# EAGLE design power (EAGLE 7.2.0)
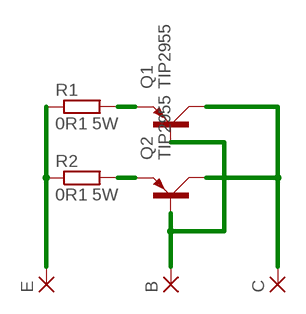
[diagram p0: schematic, sheet 1]

## Parts
B  3,81/1,4  [3,81/1,4]
C  3,81/1,4  [3,81/1,4]
E  3,81/1,4  [3,81/1,4]
Q1  TIP2955  [TOP3AV]
Q2  TIP2955  [TOP3AV]
R1  0R1 5W  R-EU_0207/15  [0207/15]
R2  0R1 5W  R-EU_0207/15  [0207/15]

## Nets
N$1: E.1(P) R1.1 R2.1
N$2: Q1.E R1.2
N$3: Q2.E R2.2
N$4: C.1(P) Q1.C Q2.C
N$5: B.1(P) Q1.B Q2.B

## Library data of the parts
B C E = wirepad:3,81/1,4: THROUGH-HOLE PAD
Q1 Q2 = transistor-power:TIP2955: PNP TRANSISTOR
R1 R2 = rcl:R-EU_: RESISTOR, European symbol

## Board
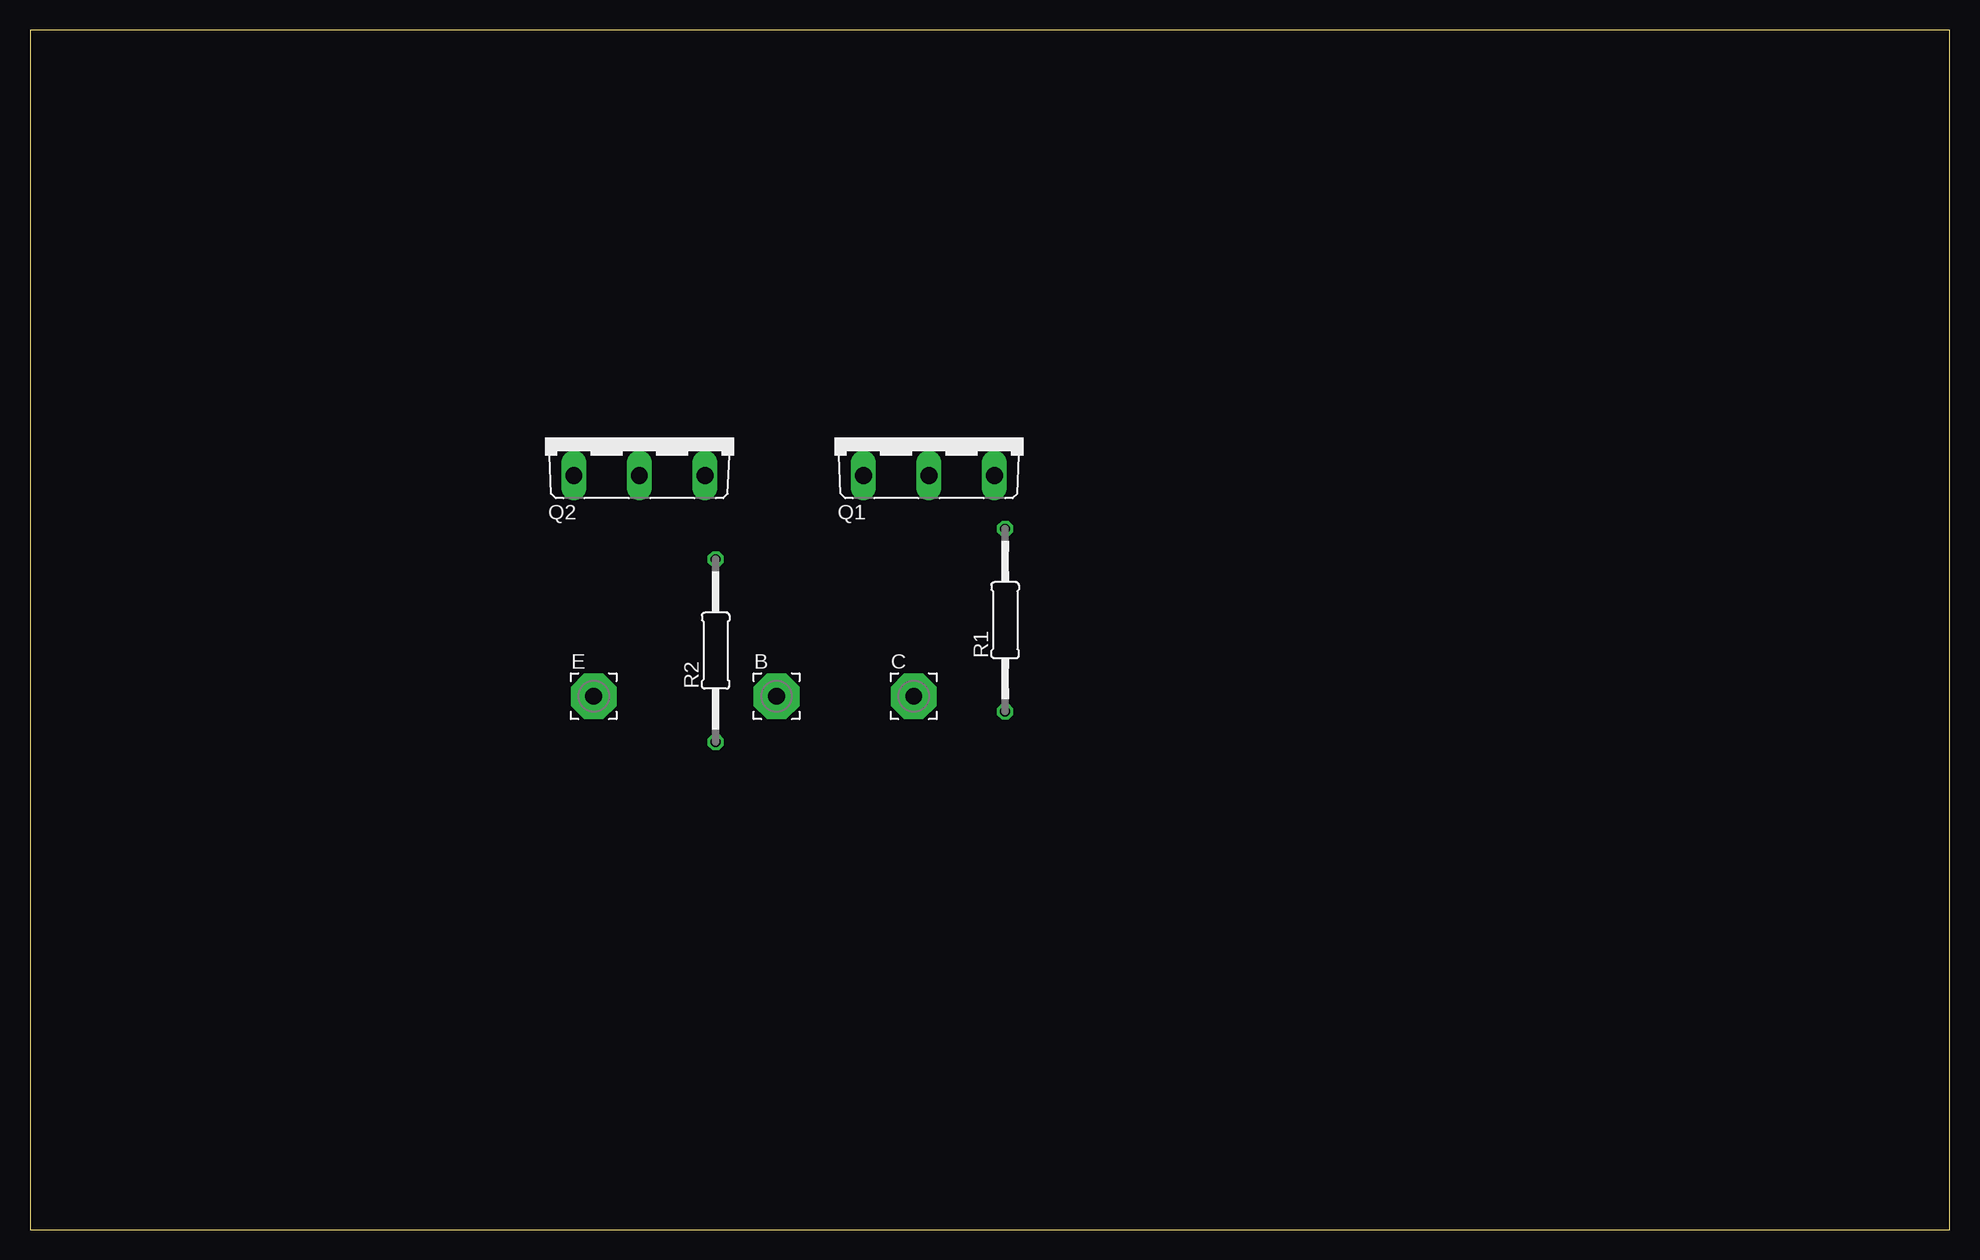
[diagram p1: board, top side]
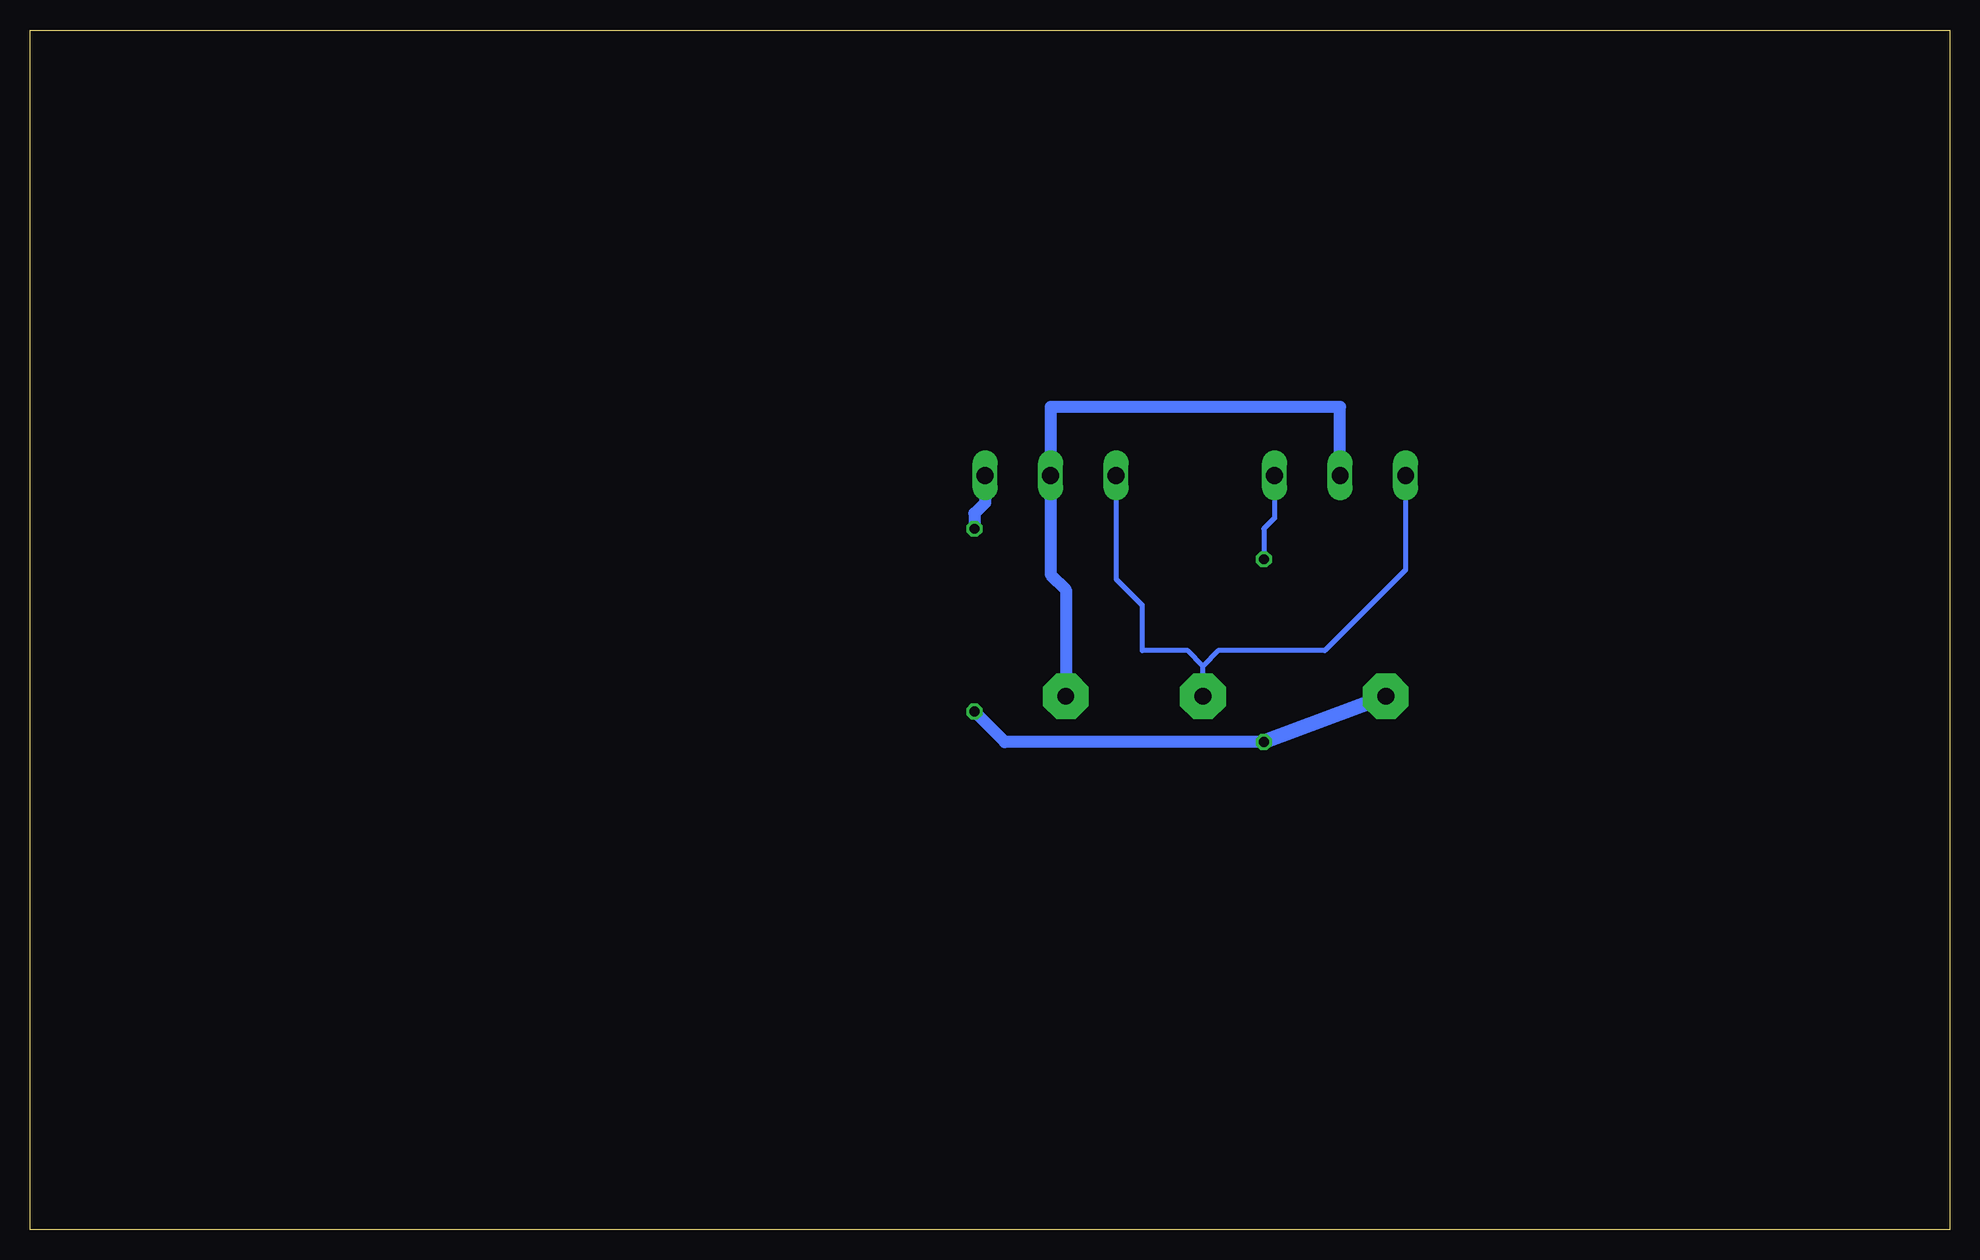
[diagram p2: board, bottom side, seen from below]

Size 160 x 100 mm. Coordinates in mm from the lower left corner, seen from the top.
Outline: 0,0 160,0 160,100 0,100 0,0
Copper layers (1*16): Top 0.035mm / dielectric 1.5mm / Bottom 0.035mm
Design rules "default": minimum track width 10mil, minimum drill 24mil, track to track 8mil, track to pad 8mil, pad to pad 8mil, via to via 8mil, smd to smd 8mil, copper to edge 40mil, drill to drill 8mil, minimum pad ring 10mil, minimum via ring 8mil, stop-mask expansion 4mil, vias tented up to drill 0mil, thermal gap 10mil

### Footprints (pad centres in the part's own frame; a part is rotated, then mirrored left to right if it is on the bottom)
3,81/1,4 = drill 1.397 pad 3.81 octagon: 1 0,0
TOP3AV = drill 1.397 long: B -5.461,-3.175; C 0,-3.175; E 5.461,-3.175
0207/15 = drill 0.813 octagon: 1 -7.62,0; 2 7.62,0

### Placement (x,y rotation side)
B  62.23,44.45 0 top
C  73.66,44.45 0 top
E  46.99,44.45 0 top
Q1  74.93,66.04 0 top
Q2  50.8,66.04 0 top
R1  81.28,50.8 90 top
R2  57.15,48.26 90 top

### Tracks (layer width: path | path; a pad name or v marks a point on that pad's centre or on a via)
N$1
  Bottom 1.016: R2.1 78.74,40.64 R1.1
  Bottom 1.27: E.1 R2.1
N$2
  Bottom 1.016: Q1.E 80.39,60.58 81.28,59.69 R1.2
N$3
  Bottom 0.406: Q2.E 56.26,59.31 57.15,58.42 R2.2
N$4
  Bottom 0.406: Q2.C 50.8,68.58 74.93,68.58 Q1.C
  Bottom 1.016: Q1.C 74.93,54.61 73.66,53.34 C.1
N$5
  Bottom 0.406: Q2.B 45.34,54.99 52.07,48.26 60.96,48.26 62.23,46.99 | B.1 62.23,46.99 | 62.23,46.99 63.5,48.26 67.31,48.26 67.31,52.07 69.47,54.23 Q1.B
N$6
  Bottom 1.016: 50.8,62.23 50.8,68.58 74.93,68.58 74.93,63.5